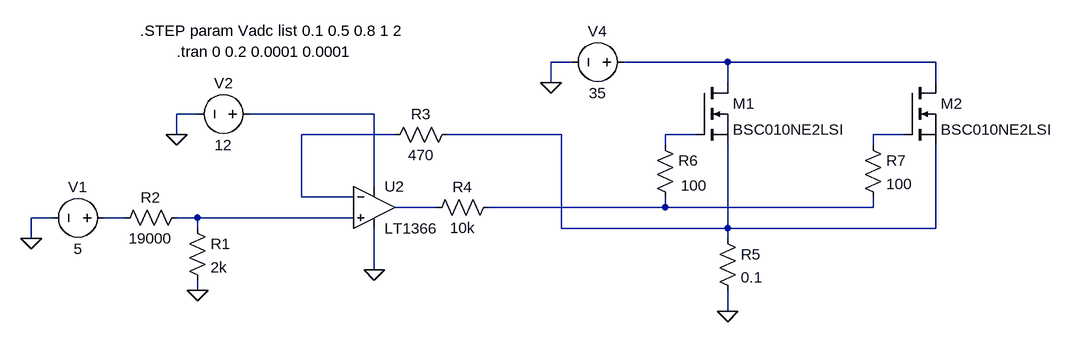
[diagram p0: schematic CCload.asc]
CCload.asc, the LTspice schematic file:
Version 4
SHEET 1 1104 680
WIRE 256 -192 224 -192
WIRE 496 -192 336 -192
WIRE 816 -192 496 -192
WIRE 224 -160 224 -192
WIRE 496 -160 496 -192
WIRE 816 -160 816 -192
WIRE -320 -112 -352 -112
WIRE -48 -112 -240 -112
WIRE -352 -80 -352 -112
WIRE -16 -80 -160 -80
WIRE 240 -80 64 -80
WIRE 448 -80 400 -80
WIRE 768 -80 720 -80
WIRE 400 -64 400 -80
WIRE 720 -64 720 -80
WIRE -48 0 -48 -112
WIRE -160 16 -160 -80
WIRE -80 16 -160 16
WIRE 48 32 -16 32
WIRE 400 32 400 16
WIRE 400 32 128 32
WIRE 720 32 720 16
WIRE 720 32 400 32
WIRE -544 48 -576 48
WIRE -432 48 -464 48
WIRE -320 48 -352 48
WIRE -80 48 -320 48
WIRE -320 64 -320 48
WIRE 240 64 240 -80
WIRE 496 64 496 -64
WIRE 496 64 240 64
WIRE 816 64 816 -64
WIRE 816 64 496 64
WIRE -576 80 -576 48
WIRE 496 80 496 64
WIRE -48 128 -48 64
WIRE -320 160 -320 144
WIRE 496 192 496 160
FLAG -576 80 0
FLAG -352 -80 0
FLAG 224 -160 0
FLAG 496 192 0
FLAG -48 128 0
FLAG -320 160 0
SYMBOL voltage -448 48 R90
WINDOW 0 -32 56 VBottom 2
WINDOW 3 32 56 VTop 2
WINDOW 123 0 0 Left 2
WINDOW 39 0 0 Left 2
SYMATTR InstName V1
SYMATTR Value 5
SYMBOL voltage -224 -112 R90
WINDOW 0 -32 56 VBottom 2
WINDOW 3 32 56 VTop 2
WINDOW 123 0 0 Left 2
WINDOW 39 0 0 Left 2
SYMATTR InstName V2
SYMATTR Value 12
SYMBOL res 80 -96 R90
WINDOW 0 0 56 VBottom 2
WINDOW 3 32 56 VTop 2
SYMATTR InstName R3
SYMATTR Value 470
SYMBOL res 144 16 R90
WINDOW 0 0 56 VBottom 2
WINDOW 3 32 56 VTop 2
SYMATTR InstName R4
SYMATTR Value 10k
SYMBOL nmos 448 -160 R0
SYMATTR InstName M1
SYMATTR Value BSC010NE2LSI
SYMBOL voltage 352 -192 R90
WINDOW 0 -32 56 VBottom 2
WINDOW 3 32 56 VTop 2
WINDOW 123 0 0 Left 2
WINDOW 39 0 0 Left 2
SYMATTR InstName V4
SYMATTR Value 35
SYMBOL res 480 64 R0
SYMATTR InstName R5
SYMATTR Value 0.1
SYMBOL res -336 48 R0
SYMATTR InstName R1
SYMATTR Value 2k
SYMBOL res -336 32 R90
WINDOW 0 0 56 VBottom 2
WINDOW 3 32 56 VTop 2
SYMATTR InstName R2
SYMATTR Value 19000
SYMBOL Opamps\\LT1366 -48 -32 R0
SYMATTR InstName U2
SYMBOL nmos 768 -160 R0
SYMATTR InstName M2
SYMATTR Value BSC010NE2LSI
SYMBOL res 384 -80 R0
WINDOW 3 40 78 Left 2
SYMATTR InstName R6
SYMATTR Value 100
SYMBOL res 704 -80 R0
SYMATTR InstName R7
SYMATTR Value 100
TEXT -408 -240 Left 2 !.STEP param Vadc list 0.1 0.5 0.8 1 2
TEXT -352 -208 Left 2 !.tran 0 0.2 0.0001 0.0001

The netlist it stands for:
* CCload.asc
V1 N009 0 5
V2 N002 0 12
R3 N004 N003 470
R4 N008 N007 10k
M1 N001 N005 N004 N004 BSC010NE2LSI
V4 N001 0 35
R5 N004 0 0.1
R1 N010 0 2k
R2 N010 N009 19000
XU2 N010 N003 N002 0 N007 LT1366  ; pins In+ In- V+ V- OUT
M2 N001 N006 N004 N004 BSC010NE2LSI
R6 N005 N008 100
R7 N006 N008 100
.model NMOS NMOS
.model PMOS PMOS
.lib standard.mos
.STEP param Vadc list 0.1 0.5 0.8 1 2
.tran 0 0.2 0.0001 0.0001
.lib LTC.lib
.backanno
.end